# EAGLE design RefVoltage (EAGLE 7.3.0)
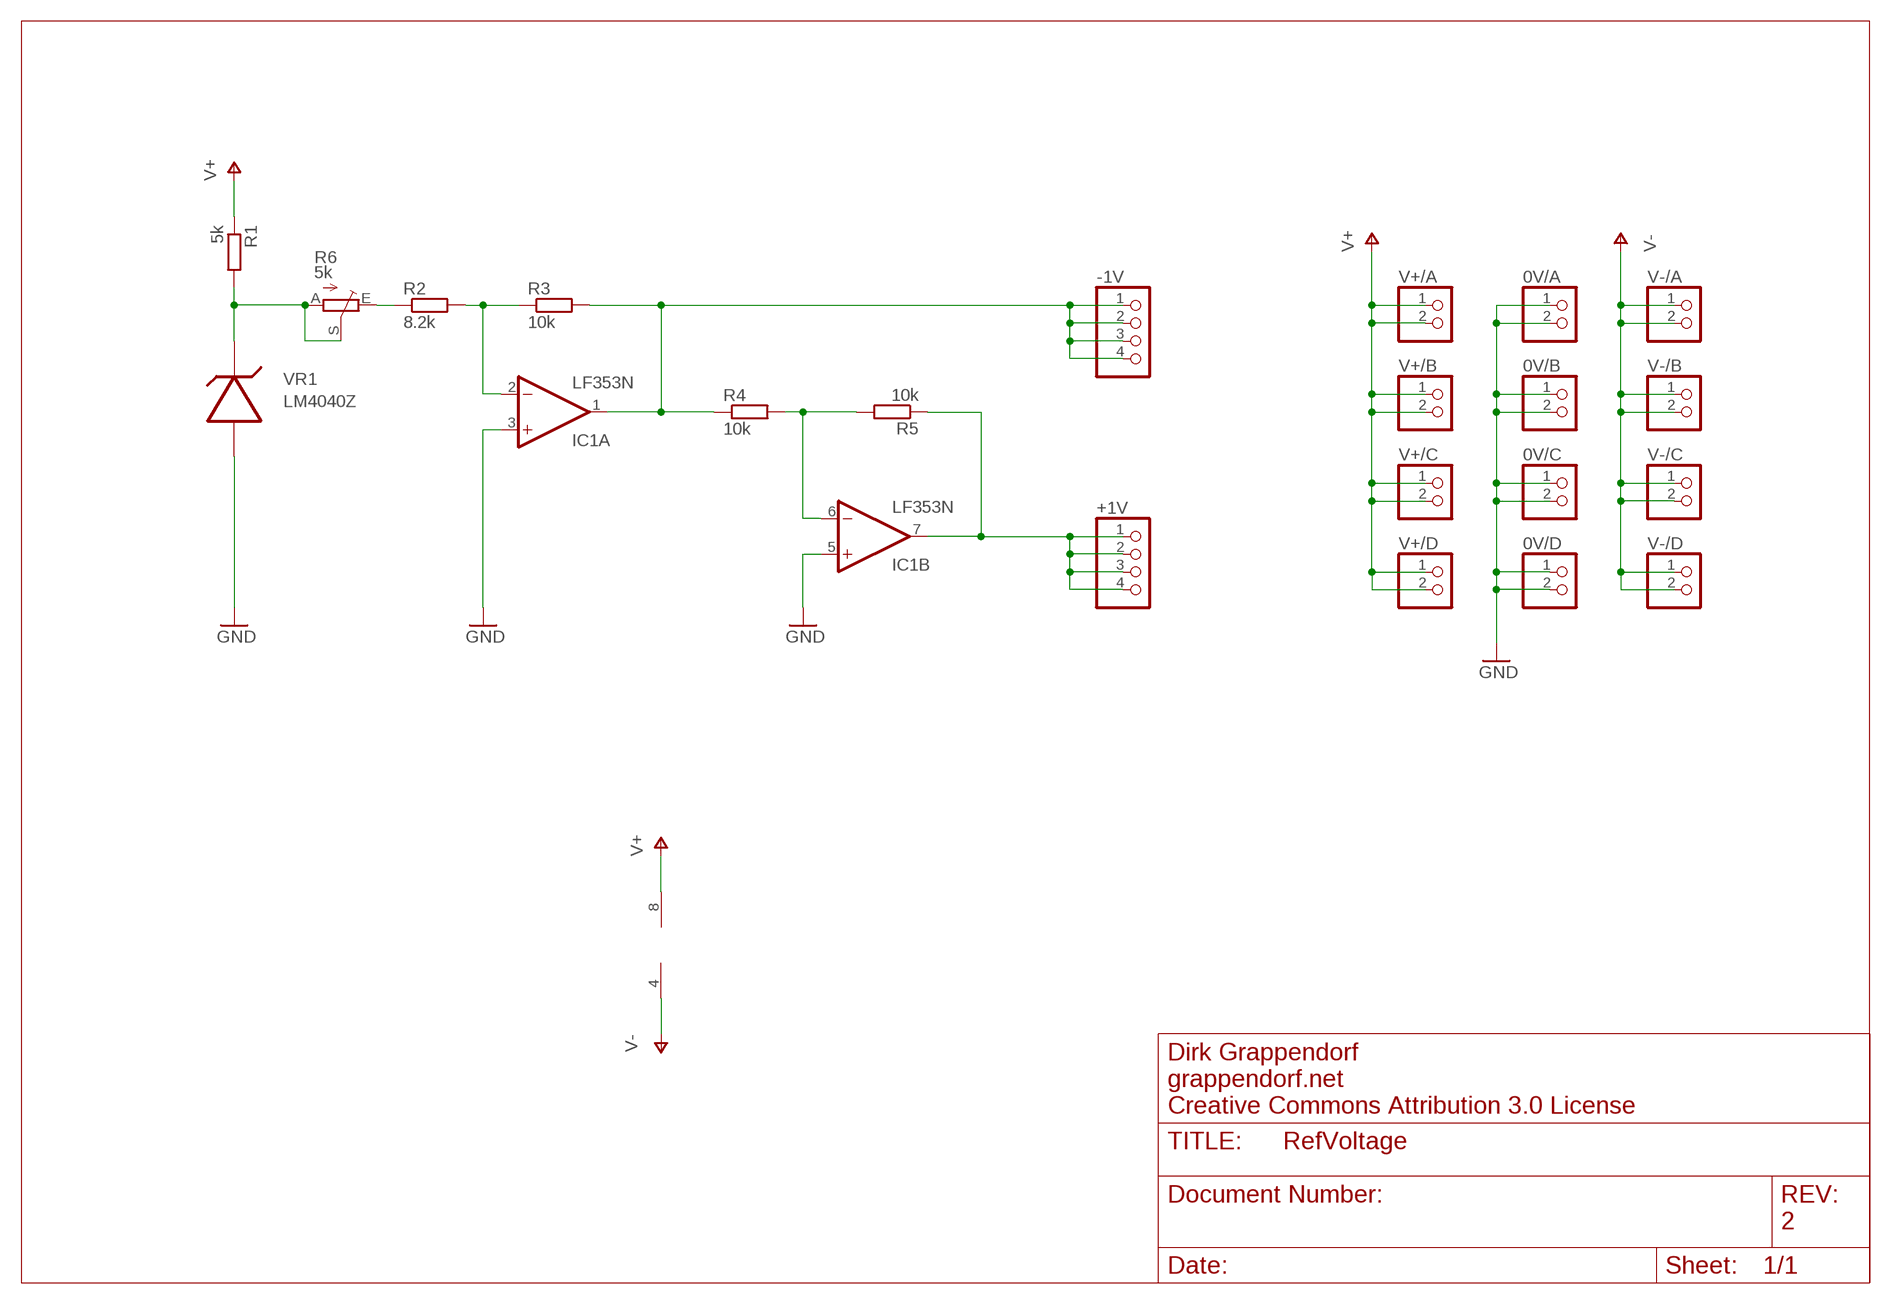
[diagram p0: schematic, sheet 1]

## Parts
0V/A  PINHD-1X2  [1X02]
0V/B  PINHD-1X2  [1X02]
0V/C  PINHD-1X2  [1X02]
0V/D  PINHD-1X2  [1X02]
+1V  PINHD-1X4  [1X04]
-1V  PINHD-1X4  [1X04]
IC1  LF353N  [DIL08]
R1  5k  R-EU_0207/7  [0207/7]
R2  8.2k  R-EU_0207/7  [0207/7]
R3  10k  R-EU_0207/7  [0207/7]
R4  10k  R-EU_0207/7  [0207/7]
R5  10k  R-EU_0207/7  [0207/7]
R6  5k  TRIM_EU-LI10  [LI10]
V+/A  PINHD-1X2  [1X02]
V+/B  PINHD-1X2  [1X02]
V+/C  PINHD-1X2  [1X02]
V+/D  PINHD-1X2  [1X02]
V-/A  PINHD-1X2  [1X02]
V-/B  PINHD-1X2  [1X02]
V-/C  PINHD-1X2  [1X02]
V-/D  PINHD-1X2  [1X02]
VR1  LM4040Z  [TO92]

## Nets
GND: 0V/A.1 0V/A.2 0V/B.1 0V/B.2 0V/C.1 0V/C.2 0V/D.1 0V/D.2 IC1.3(A:+IN) IC1.5(B:+IN) VR1.3
N$1: R1.2 R6.A R6.S VR1.2
N$2: IC1.2(A:-IN) R2.2 R3.1
N$3: IC1.6(B:-IN) R4.2 R5.2
N$4: -1V.1 -1V.2 -1V.3 -1V.4 IC1.1(A:OUT) R3.2 R4.1
N$5: +1V.1 +1V.2 +1V.3 +1V.4 IC1.7(B:OUT) R5.1
N$6: R2.1 R6.E
V+: IC1.8(P:V+) R1.1 V+/A.1 V+/A.2 V+/B.1 V+/B.2 V+/C.1 V+/C.2 V+/D.1 V+/D.2
V-: IC1.4(P:V-) V-/A.1 V-/A.2 V-/B.1 V-/B.2 V-/C.1 V-/C.2 V-/D.1 V-/D.2

## Notes on the sheet
- Dirk Grappendorf
- grappendorf.net
- Creative Commons Attribution 3.0 License
- 2

## Library data of the parts
0V/A 0V/B 0V/C 0V/D V+/A V+/B V+/C V+/D V-/A V-/B V-/C V-/D = pinhead:PINHD-1X2: PIN HEADER
+1V -1V = pinhead:PINHD-1X4: PIN HEADER
IC1 = linear:LF353: OP AMP
R1-R5 = rcl:R-EU_: RESISTOR, European symbol
R6 = pot:TRIM_EU-: POTENTIOMETER
VR1 = grapelabs:LM4040: Shunt VOLTAGE REG.

## Board
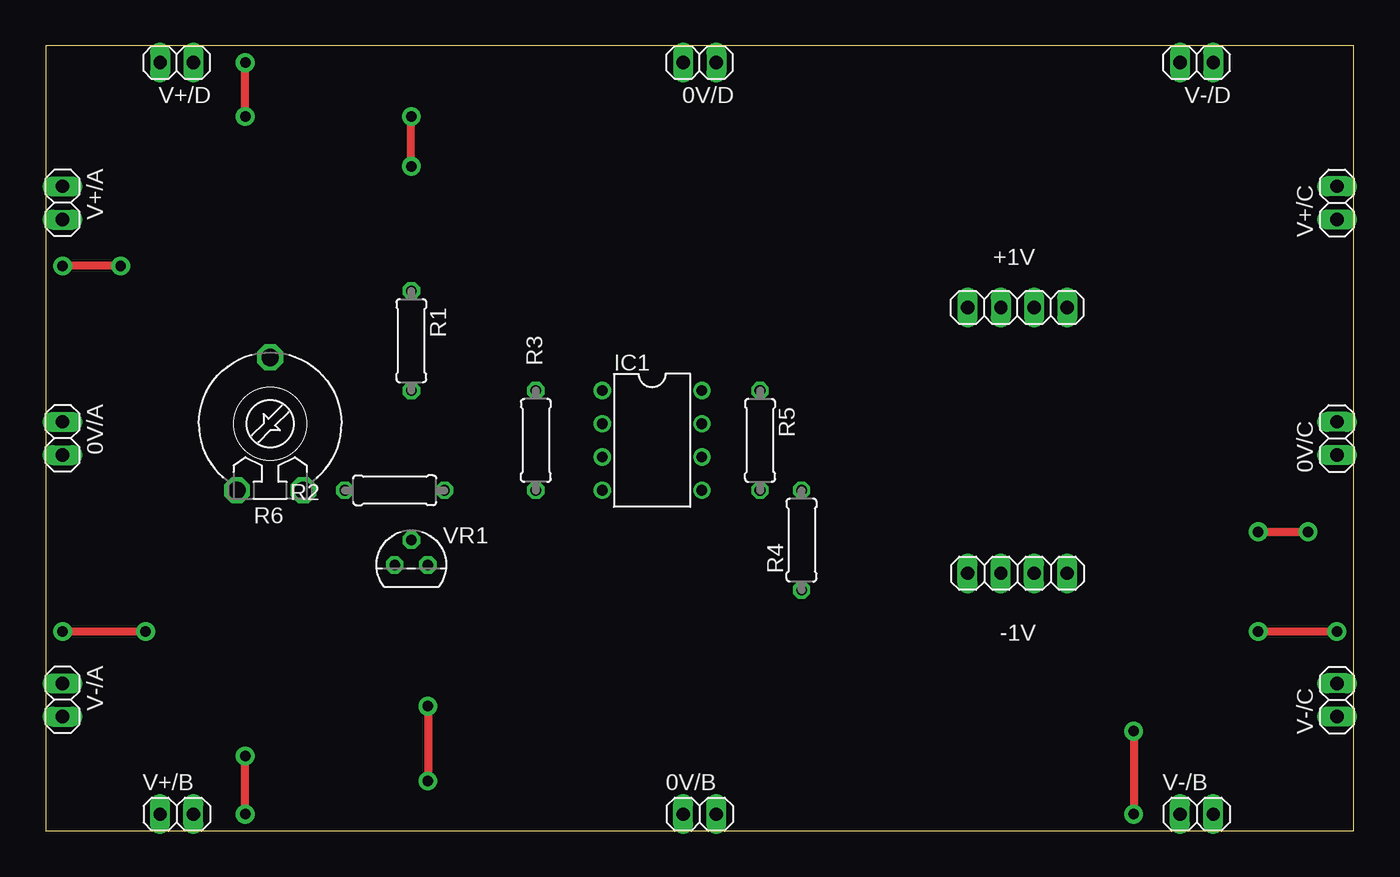
[diagram p1: board, top side]
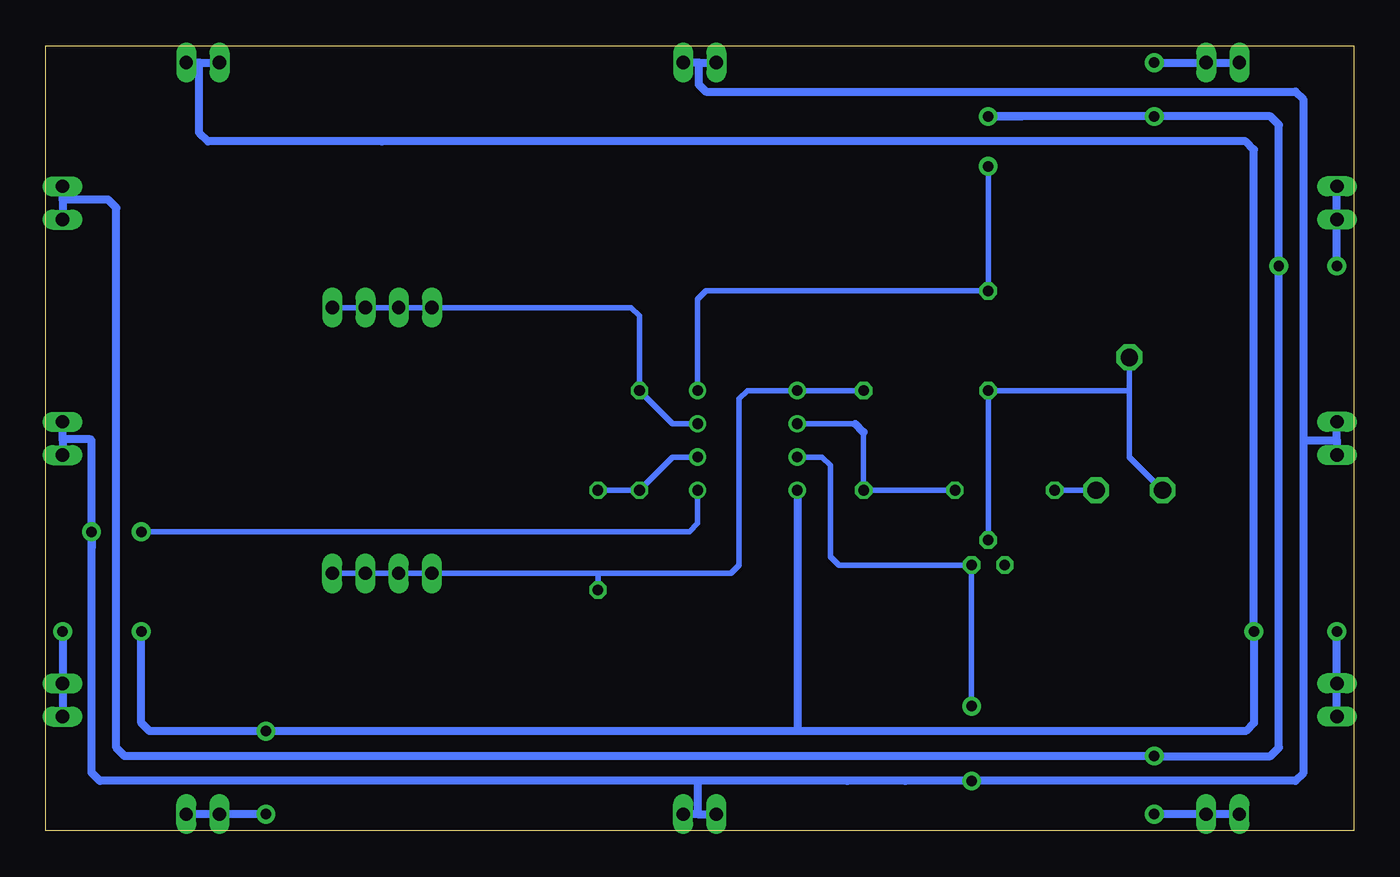
[diagram p2: board, bottom side, seen from below]

Size 100 x 60 mm. Coordinates in mm from the lower left corner, seen from the top.
Outline: 0,0 100,0 100,60 0,60 0,0
Copper layers (1*16): Top 0.035mm / dielectric 1.5mm / Bottom 0.035mm
Design rules "default *": minimum track width 10mil, minimum drill 24mil, track to track 8mil, track to pad 8mil, pad to pad 8mil, via to via 8mil, smd to smd 8mil, copper to edge 40mil, drill to drill 8mil, minimum pad ring 10mil, minimum via ring 8mil, stop-mask expansion 4mil, vias tented up to drill 0mil, thermal gap 10mil

### Footprints (pad centres in the part's own frame; a part is rotated, then mirrored left to right if it is on the bottom)
1X02 = drill 1.016 long: 1 -1.27,0; 2 1.27,0
1X04 = drill 1.016 long: 1 -3.81,0; 2 -1.27,0; 3 1.27,0; 4 3.81,0
DIL08 = drill 0.813 pad 1.27: 1 -3.81,-3.81; 2 -1.27,-3.81; 3 1.27,-3.81; 4 3.81,-3.81; 5 3.81,3.81; 6 1.27,3.81; 7 -1.27,3.81; 8 -3.81,3.81
0207/7 = drill 0.813 octagon: 1 -3.81,0; 2 3.81,0
LI10 = drill 1.321 octagon: A -2.54,-5.08; E 2.54,-5.08; S 0,5.08
TO92 = drill 0.813 octagon: 1 -1.27,0; 2 0,1.905; 3 1.27,0

### Placement (x,y rotation side)
0V/A  1.27,30 270 top
0V/B  50,1.27 0 top
0V/C  98.73,30 90 top
0V/D  50,58.73 180 top
+1V  74.3,40.01 180 top
-1V  74.3,19.68 0 top
IC1  46.35,29.84 270 top
R1  27.94,37.47 270 top
R2  26.67,26.04 0 top
R3  37.47,29.84 90 top
R4  57.78,22.23 90 top
R5  54.61,29.84 270 top
R6  17.14,31.11 0 top
V+/A  1.27,48 270 top
V+/B  10,1.27 0 top
V+/C  98.73,48 90 top
V+/D  10,58.73 180 top
V-/A  1.27,10 270 top
V-/B  88,1.27 0 top
V-/C  98.73,10 90 top
V-/D  88,58.73 180 top
VR1  27.94,20.32 0 top

### Tracks (layer width: path | path; a pad name or v marks a point on that pad's centre or on a via)
GND  (via drill 0.8)
  Top 0.61: v29.21,9.53 v29.21,3.81 | v92.71,22.86 v96.52,22.86
  Bottom 0.406: IC1.3 40.64,28.57 40.01,27.94 40.01,20.95 39.37,20.32 VR1.3 v29.21,9.53 | IC1.5 50.16,23.5 50.8,22.86 v92.71,22.86
  Bottom 0.61: 1.27,29.84 0V/A.2 | 1.27,29.84 0V/A.1 | 50.08,58.73 0V/D.2 | 50.08,58.73 0V/D.1 | 98.73,29.93 0V/C.1 98.48,28.48 | 98.73,29.93 0V/C.2 | 50.16,1.27 0V/B.1 | 50.16,1.27 0V/B.2 | 3.81,29.84 3.81,5.08 3.81,4.45 4.45,3.81 v29.21,3.81 | 3.81,29.84 3.81,55.88 4.45,56.52 49.53,56.52 50.08,57.06 50.08,58.73 | v29.21,3.81 34.29,3.81 | 34.29,3.81 38.73,3.81 50.16,3.81 | 50.16,3.81 95.89,3.81 96.52,4.45 96.52,21.59 | 96.52,21.59 v96.52,22.86 | v96.52,22.86 96.52,29.84 96.6,29.93 98.73,29.93 | 3.81,29.84 1.27,29.84 | 50.16,3.81 50.16,1.27 | v29.21,3.81 34.29,3.81 | v96.52,22.86 96.52,21.59
N$1
  Bottom 0.406: VR1.2 R1.2 17.14,33.66 | R6.A 17.14,28.57 17.14,33.66 | 17.14,33.66 R6.S
N$2
  Bottom 0.406: R2.2 R3.1 37.47,30.48 | 38.1,31.11 IC1.2
  Bottom 0.61: 37.47,30.48 38.1,31.11
N$3
  Bottom 0.406: IC1.6 52.07,28.57 R5.2 R4.2
N$4
  Bottom 0.406: R3.2 IC1.1 46.35,33.66 46.99,33.02 46.99,20.32 47.62,19.68 57.78,19.68 | -1V.4 -1V.3 -1V.2 -1V.1 57.78,19.68 | R4.1 57.78,19.68
N$5
  Bottom 0.406: IC1.7 52.07,31.11 R5.1 54.61,39.37 55.24,40.01 +1V.4 +1V.3 +1V.2 +1V.1
N$6
  Bottom 0.406: R2.1 R6.E
V+  (via drill 0.8)
  Top 0.61: v5.71,43.18 v1.27,43.18 | v15.24,1.27 v15.24,5.71 | v15.24,54.61 v15.24,58.73 | v27.94,50.8 v27.94,54.61
  Bottom 0.406: v27.94,50.8 R1.1 49.53,41.27 50.16,40.64 IC1.8
  Bottom 0.61: v1.27,43.18 V+/A.2 V+/A.1 | V+/D.2 V+/D.1 14.91,58.73 v15.24,58.73 | 98.73,48.26 V+/C.1 | 98.73,48.26 V+/C.2 | V+/B.1 V+/B.2 15.05,1.27 v15.24,1.27 | v5.71,43.18 5.71,6.35 6.35,5.71 v15.24,5.71 20.32,5.71 61.59,5.71 93.98,5.71 94.61,6.35 94.61,47.62 95.25,48.26 98.73,48.26 | v5.71,43.18 5.71,43.72 | 25.4,54.61 v15.24,54.61 6.35,54.61 5.71,53.98 v5.71,43.18 | 25.4,54.61 v27.94,54.61 25.4,54.61
V-  (via drill 0.8)
  Top 0.61: v1.27,15.24 v7.62,15.24 | v92.71,15.24 v98.73,15.24 | v83.19,7.62 v83.19,1.27
  Bottom 0.61: V-/A.2 V-/A.1 1.27,15.05 v1.27,15.24 | V-/C.1 V-/C.2 98.73,14.91 v98.73,15.24 | V-/B.2 V-/B.1 v83.19,1.27 | 88.27,58.73 V-/D.2 | 88.27,58.73 V-/D.1 | 42.55,7.62 41.91,7.62 8.26,7.62 7.62,8.26 v7.62,15.24 7.62,52.07 8.26,52.7 74.3,52.7 87.63,52.7 88.27,53.34 88.27,58.73 | 42.55,7.62 50.8,7.62 v83.19,7.62 92.08,7.62 92.71,8.26 v92.71,15.24 | IC1.4 42.55,7.62